# EasyEDA Pro project coildriver.eprj, schematic Schematic2
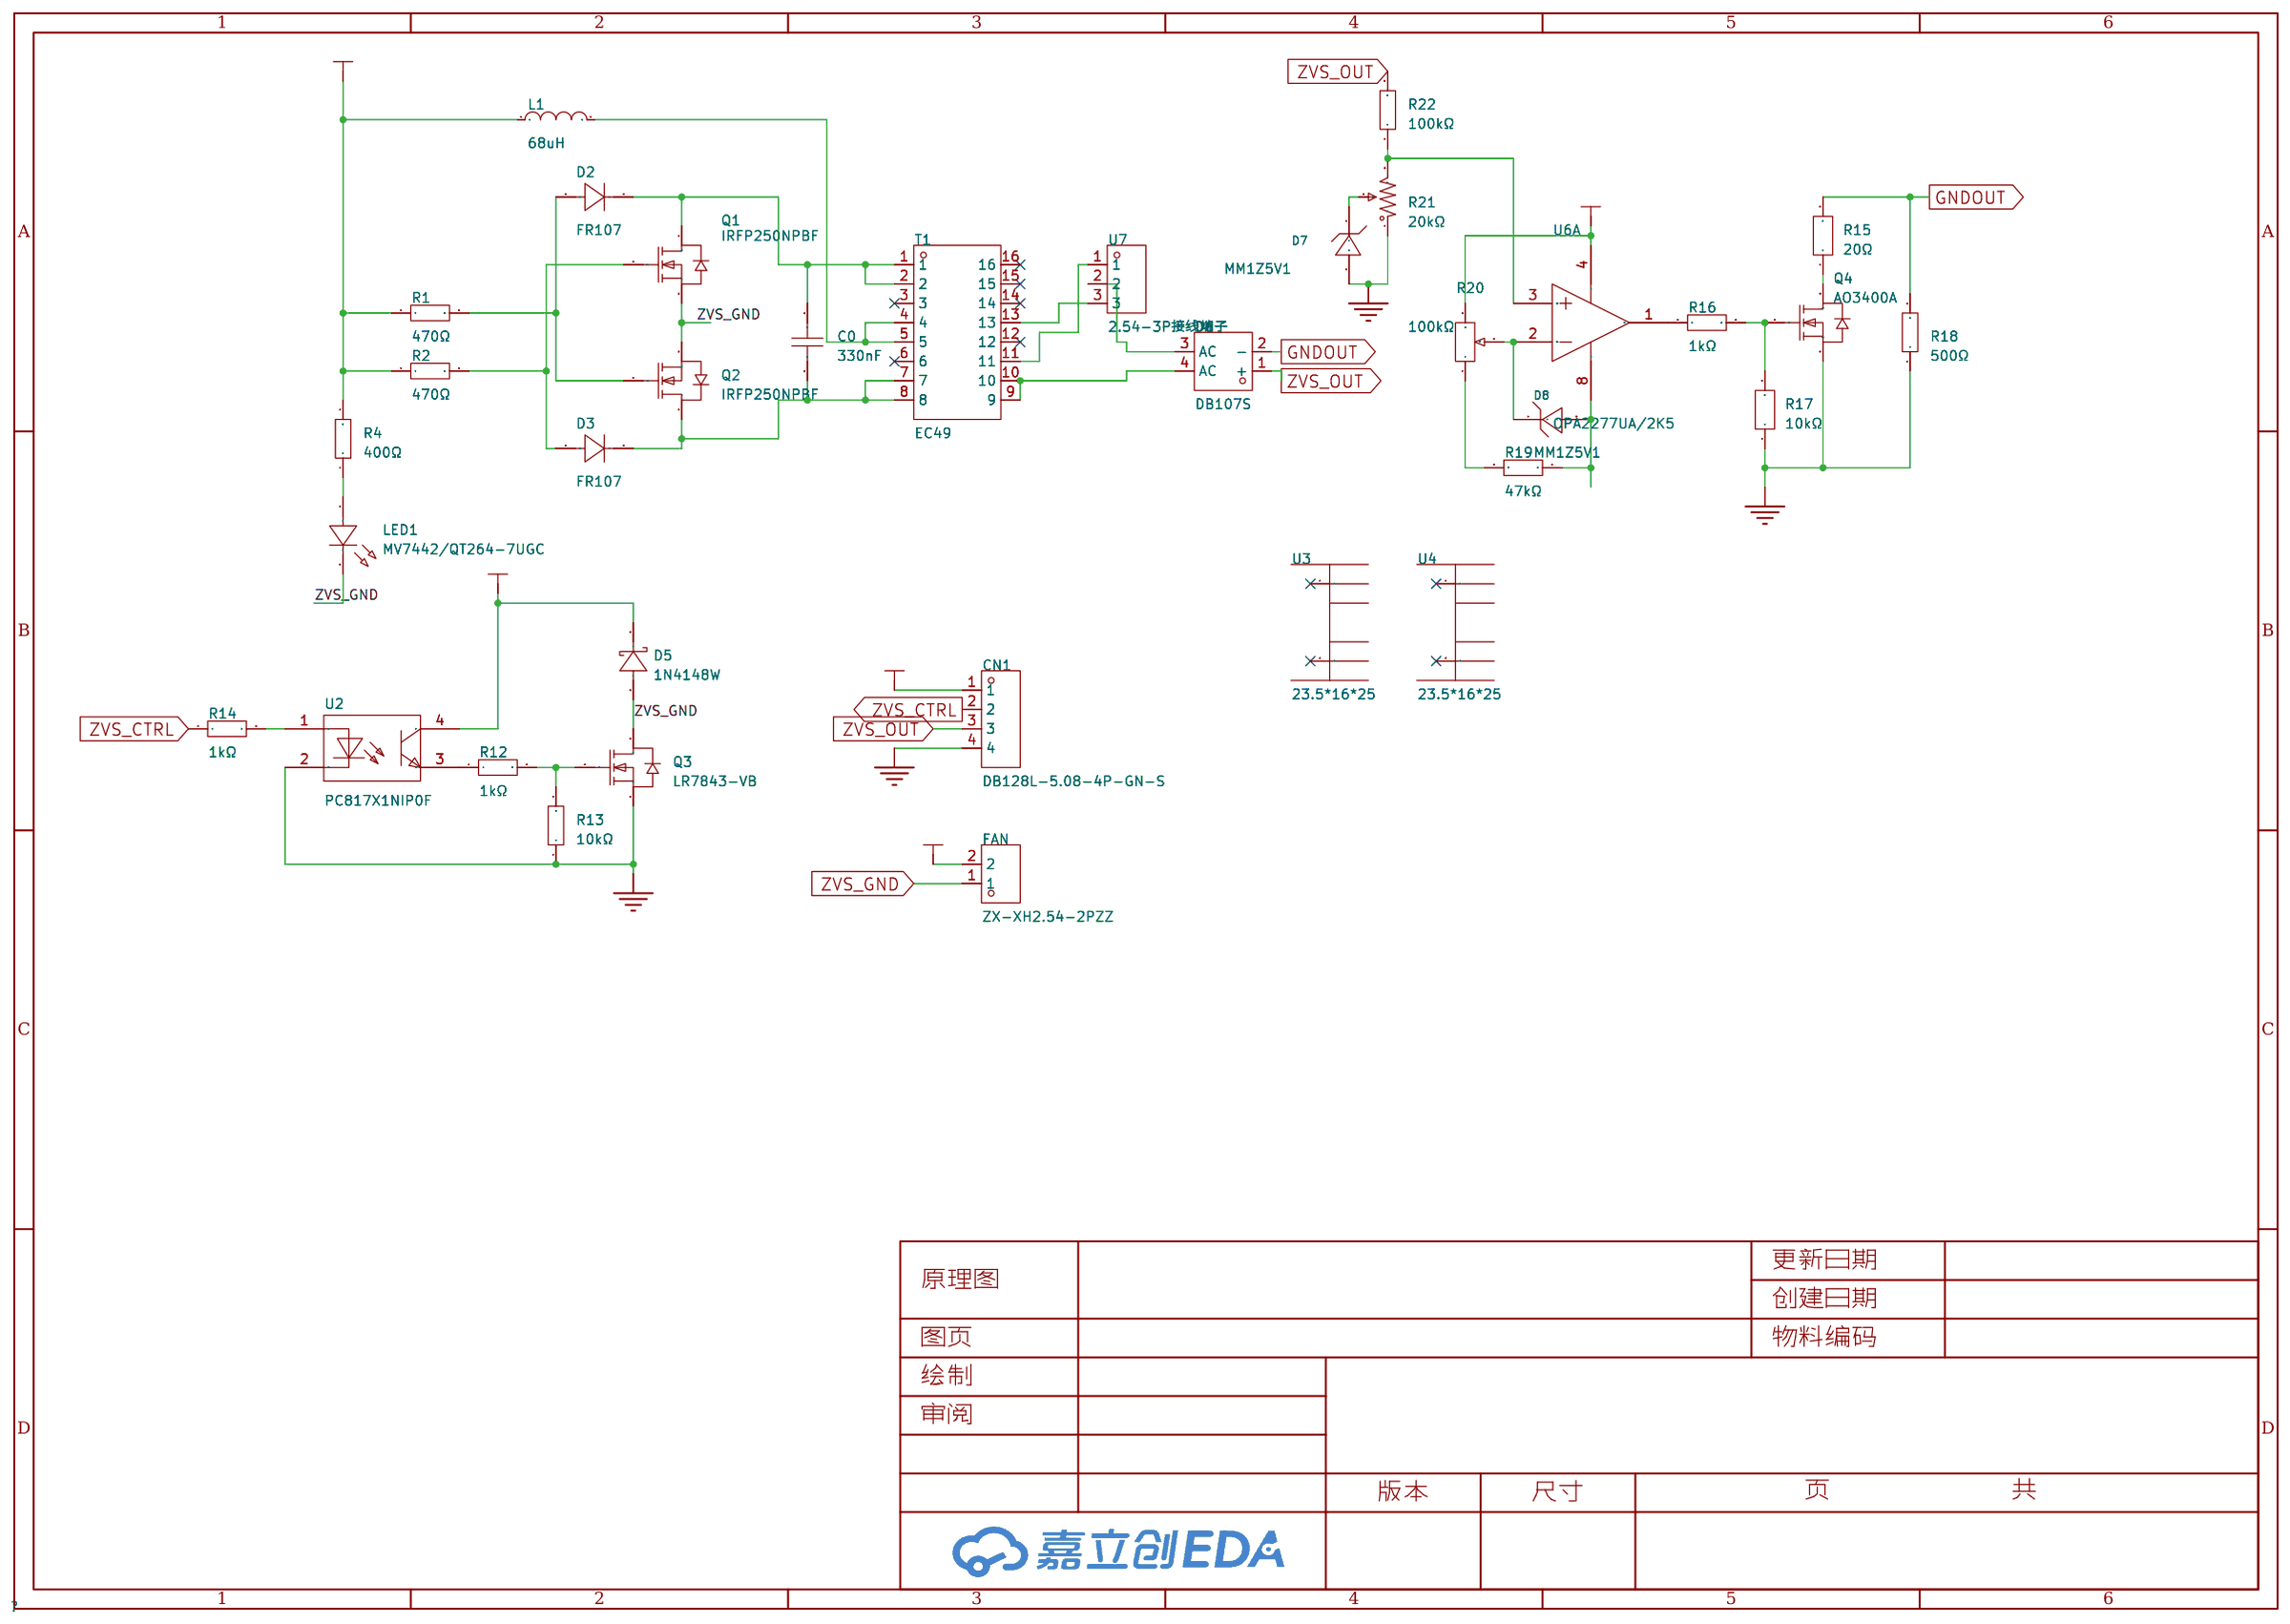
[diagram p1: schematic sheet]

## Parts
C0  330nF  [CAP-TH_L18.0-W6.0-P15.00-D0.8]
CN1  DB128L-5.08-4P-GN-S  [CONN-TH_4P_DB128L-5.08-4P-GN-S]
D2  FR107  [SOD-123FL_L2.7-W1.8-LS3.8-RD]
D3  FR107  [SOD-123FL_L2.7-W1.8-LS3.8-RD]
D5  1N4148W  [SOD-123_L2.7-W1.6-LS3.7-FD]
D6  DB107S  [DBS_L8.2-W6.4-P5.10-LS10.0-BL]
D7  MM1Z5V1  [SOD-123_L2.8-W1.8-LS3.7-RD]
D8  MM1Z5V1  [SOD-123_L2.8-W1.8-LS3.7-RD]
FAN  ZX-XH2.54-2PZZ  [CONN-TH_2P-P2.50_HX25003-2A]
L1  68uH  [IND-TH_L21.0-W11.0-P10.00]
LED1  MV7442/QT264-7UGC  [LED-TH_BD3.0-P2.54-FD]
Q1  IRFP250NPBF  [TO-247AC-3_L15.8-W5.0-P5.46-L]
Q2  IRFP250NPBF  [TO-247AC-3_L15.8-W5.0-P5.46-L]
Q3  LR7843-VB  [TO-252-2_L6.6-W6.1-P4.58-LS9.9-BR]
Q4  AO3400A  [SOT-23-3_L2.9-W1.3-P1.90-LS2.4-BR]
R1  470Ω  [R1206]
R2  470Ω  [R1206]
R4  400Ω  [R0805]
R12  1kΩ  [R0603]
R13  10kΩ  [R0603]
R14  1kΩ  [R0603]
R15  20Ω  [RES-TH_BD4.5-L11.0-P15.00-D0.7]
R16  1kΩ  [R0603]
R17  10kΩ  [R0603]
R18  500Ω  [RES-TH_BD9.0-L31.5-P35.50-D0.8]
R19  47kΩ  [R0603]
R20  100kΩ  [RES-ADJ-TH_3P-L9.5-W4.9-P2.50-L_3296W]
R21  20kΩ  [RES-ADJ-TH_3P-L10.0-W10.0-P2.50-BL-BS]
R22  100kΩ  [R0603]
T1  EC49  [XFMR-TH_16P-L40.0-W40.0-P5.00-LS35.0-BL]
U2  PC817X1NIP0F  [OPTO-SMD-4_L4.6-W6.5-P2.54-LS10.3-BL]
U3  23.5*16*25  [HEATSINK-TH_L23.5-W16.0-P18.0_XSD2156-067]
U4  23.5*16*25  [HEATSINK-TH_L23.5-W16.0-P18.0_XSD2156-067]
U6  OPA2277UA/2K5  [SOIC-8_L5.0-W4.0-P1.27-LS6.0-BL]  (section 1)
U7  2.54-3P接线端子  [CONN-TH_2.54-3P]

## Library data of the parts
C0 = MPX334K31D2KN15800: LCSC Part Name: 330nF ±10% 275V 305V 310V 等级:X2; Supplier Part: C504201; Manufacturer: KNSCHA(科尼盛); Supplier Footprint: 插件,P=15mm; JLCPCB Part Class: 扩展库; Datasheet: https://atta.szlcsc.com/upload/public/pdf/source/20200409/C504201_262CED3AA358BCF37F005B56DB63EB22.pdf; Supplier: LCSC; Tolerance: ±10%; Voltage(AC): 275V；310V；305V; Subclass: X2; safety certification: UL；CUL；KC；ENEC；VDE；CQC; Operating Temperature: -40℃~+110℃
CN1 = DB128L-5.08-4P-GN-S: LCSC Part Name: 5.08mm 1x4P 排数:1 每排P数:4 直插; Supplier Part: C2827883; Manufacturer: DORABO(地博电气); Supplier Footprint: 插件,P=5.08mm; JLCPCB Part Class: 扩展库; Datasheet: https://atta.szlcsc.com/upload/public/pdf/source/20230106/B067FE0E641A396A370D47F93C345689.pdf; Supplier: LCSC; Structure: 1x4P; Pitch: 5.08mm; Color: 绿色; Mounting Style: 直插; Current Rating (Max): 18A; Voltage Rating (Max): 250V; Number of Pins: 4P; Number of Rows: 1; Wire Gauge - AWG: 12~30; Wire Gauge - mm2: 2.5; Number of PINs Per Row: 4; Operating Temperature Range: -40℃~+105℃
D2 D3 = FR107_C2760867: LCSC Part Name: 电压:1kV 电流:1A; Supplier Part: C2760867; Manufacturer: Slkor(萨科微); Supplier Footprint: SOD-123FL; JLCPCB Part Class: 扩展库; Datasheet: https://atta.szlcsc.com/upload/public/pdf/source/20210316/C2760867_0B45AFF5F62837EEEC945A80EBBE02AA.pdf; Supplier: LCSC; Diode Configuration: 独立式; Forward Voltage (Vf@If): 1.3V@1A; Reverse Voltage (Vr): 1kV; Average Rectified Current (Io): 1A; Reverse Leakage Current: 5uA@1kV; Reverse Recovery Time (trr): 500ns; Operating Temperature: -55℃~+150℃@(Tj)
D5 = 1N4148W_C7420318: LCSC Part Name: 电压:100V 电流:150mA; Supplier Part: C7420318; Manufacturer: 宏迦橙; Supplier Footprint: SOD-123; JLCPCB Part Class: 扩展库; Datasheet: https://atta.szlcsc.com/upload/public/pdf/source/20230828/E5C3F7A4272052930A7E03B75759BF50.pdf; Supplier: LCSC; Diode Configuration: 独立式; Forward Voltage (Vf@If): 1.25V@150mA; Reverse Voltage (Vr): 100V; Average Rectified Current (Io): 150mA; Power Dissipation: 400mW; Reverse Leakage Current: 1uA@75V; Reverse Recovery Time (trr): 4ns; Operating Temperature: -55℃~+150℃
D6 = DB107S_C5377: LCSC Part Name: 电压:1kV 电流:1A; Supplier Part: C5377; Manufacturer: MDD(辰达半导体); Supplier Footprint: DBS; JLCPCB Part Class: Extended Part; Datasheet: https://atta.szlcsc.com/upload/public/pdf/source/20230823/A59C303B9E2BAE19B2E40C847717A366.pdf; Supplier: LCSC; Forward Voltage (Vf@If): 1.1V@1A; Reverse Voltage (Vr): 1kV; Rectified Current: 1A; Reverse Leakage Current (Ir): 10uA@1kV; Peak Forward Surge Current: 30A; Operating Temperature: -55℃~+150℃@(Tj)
D7 D8 = MM1Z5V1_C112534: Supplier Part: C112534; Manufacturer: 晶导微电子; Supplier Footprint: SOD-123; JLCPCB Part Class: 扩展库; Datasheet: https://atta.szlcsc.com/upload/public/pdf/source/20190326/C382779_93A8490AC8548BE170FED91286A619FB.pdf; Supplier: LCSC; Diode Configuration: 独立式; Zener Voltage (Nom): 5.1V; Reverse Leakage Current (Ir): 2uA@1.5V; Zener Voltage (Range): 4.8V~5.4V; Power Dissipation: 500mW; Zener Impedance (Zzt): 130Ω; Tolerance: ±6%
FAN = ZX-XH2.54-2PZZ: Supplier Part: C7429632; Manufacturer: Megastar(兆星); Supplier Footprint: 插件,P=2.54mm; JLCPCB Part Class: 扩展库; Datasheet: https://atta.szlcsc.com/upload/public/pdf/source/20230619/19BA6947230AA44A04D3EDD65E618FD0.pdf; Supplier: LCSC; Pins Structure: 1x2P; Pitch: 2.54mm; Mounting Style: 直插; Reference Series: XH; Number of Pins: 2P; Number of Rows: 1; Number of PINs Per Row: 2; Current Rating (Max): 3A; Contact Material: 黄铜; Contact Plating: 锡; Operating Temperature Range: -25℃~+85℃
L1 = SLT065125T680MTB: LCSC Part Name: 磁环电感 68uH ±20%; Supplier Part: C908340; Manufacturer: Sunltech(韩国顺磁); Supplier Footprint: 插件; JLCPCB Part Class: 扩展库; Datasheet: https://atta.szlcsc.com/upload/public/pdf/source/20201022/C908340_B9E676A8CE1D5E7140E465A9B41BC04C.pdf; Supplier: LCSC; Tolerance: ±20%; DC Resistance: 50mΩ; Type: 磁环电感
LED1 = MV7442/QT264-7UGC: Supplier Part: C17701866; Manufacturer: EVERLIGHT(亿光); Supplier Footprint: 插件; Datasheet: https://atta.szlcsc.com/upload/public/pdf/source/20230912/D387E63BEA7E9939EEB3DC7E43700318.pdf; Supplier: LCSC
Q1 Q2 = IRFP250NPBF: LCSC Part Name: 1个N沟道 耐压:200V 电流:30A; Supplier Part: C2580; Manufacturer: Infineon(英飞凌); Supplier Footprint: TO-247AC-3; JLCPCB Part Class: 扩展库; Datasheet: https://atta.szlcsc.com/upload/public/pdf/source/20140906/1457707236269.pdf; Supplier: LCSC; Type: 1个N沟道; Drain Source Voltage (Vdss): 200V; Continuous Drain Current (Id): 30A; Power Dissipation (Pd): 214W; Drain Source On Resistance (RDS(on)@Vgs,Id): 75mΩ@10V,18A; Gate Threshold Voltage (Vgs(th)@Id): 4V@250uA; Total Gate Charge (Qg@Vgs): 123nC@10V; Input Capacitance (Ciss@Vds): 2.159nF@25V; Operating Temperature: -55℃~+175℃@(Tj)
Q3 = LR7843-VB: LCSC Part Name: 1个N沟道 耐压:30V 电流:120A; Supplier Part: C5137375; Manufacturer: VBsemi(微碧半导体); Supplier Footprint: TO-252; JLCPCB Part Class: 扩展库; Datasheet: https://atta.szlcsc.com/upload/public/pdf/source/20230505/168126473CAC651DFC47C090452CBF08.pdf; Supplier: LCSC; Type: 1个N沟道; Drain Source Voltage (Vdss): 30V; Continuous Drain Current (Id): 120A; Drain Source On Resistance (RDS(on)@Vgs,Id): 2.3mΩ@10V,120A
Q4 = AO3400A_C20917: LCSC Part Name: 1个N沟道 耐压:30V 电流:5.7A; Supplier Part: C20917; Manufacturer: AOS; Supplier Footprint: SOT-23-3L; JLCPCB Part Class: 基础库; Datasheet: https://atta.szlcsc.com/upload/public/pdf/source/20140107/1457706668533.pdf; Supplier: LCSC; Type: 1个N沟道; Drain Source Voltage (Vdss): 30V; Continuous Drain Current (Id): 5.7A; Power Dissipation (Pd): 1.4W; Drain Source On Resistance (RDS(on)@Vgs,Id): 26.5mΩ@10V,5.7A; Gate Threshold Voltage (Vgs(th)@Id): 1.5V@250uA; Total Gate Charge (Qg@Vgs): 7nC@4.5V; Input Capacitance (Ciss@Vds): 630pF@15V; Operating Temperature: -55℃~+150℃@(Tj)
R1 R2 = 1206W4F4700T5E: LCSC Part Name: 470Ω ±1% 250mW 厚膜电阻; Supplier Part: C4502; Manufacturer: UNI-ROYAL(厚声); Supplier Footprint: 1206; JLCPCB Part Class: 扩展库; Datasheet: https://atta.szlcsc.com/upload/public/pdf/source/20200306/C422600_1E6D84923E4A46A82E41ADD87F860B5C.pdf; Supplier: LCSC; Type: 厚膜电阻; Tolerance: ±1%; Power(Watts): 250mW; Overload Voltage (Max): 200V; Temperature Coefficient: ±100ppm/℃; Operating Temperature Range: -55℃~+155℃
R4 = TR0805B400RP0525Z: LCSC Part Name: 薄膜电阻 400Ω ±0.1% 125mW; Supplier Part: C153298; Manufacturer: EVER OHMS(天二科技); Supplier Footprint: 0805; JLCPCB Part Class: 扩展库; Datasheet: https://atta.szlcsc.com/upload/public/pdf/source/20190527/C149900_32B1354086E9F6A772108AB7B2B7A514.pdf; Supplier: LCSC; Type: 薄膜电阻; Tolerance: ±0.1%; Power(Watts): 125mW; Overload Voltage (Max): 150V; Temperature Coefficient: ±25ppm/℃; Operating Temperature Range: -55℃~+155℃
R12 R14 R16 = RC0603FR-071KL: LCSC Part Name: 厚膜电阻 1kΩ ±1% 100mW; Supplier Part: C22548; Manufacturer: YAGEO(国巨); Supplier Footprint: 0603; JLCPCB Part Class: 扩展库; Datasheet: https://atta.szlcsc.com/upload/public/pdf/source/20180316/70C0E2BDAE7FCC62C531A5A58D202EE1.pdf; Supplier: LCSC; Type: 厚膜电阻; Tolerance: ±1%; Power(Watts): 100mW; Overload Voltage (Max): 75V; Temperature Coefficient: ±100ppm/℃; Operating Temperature Range: -55℃~+155℃
R13 = 0603WAF1002T5E: LCSC Part Name: 厚膜电阻 10kΩ ±1% 100mW; Supplier Part: C25804; Manufacturer: UNI-ROYAL(厚声); Supplier Footprint: 0603; JLCPCB Part Class: 基础库; Datasheet: https://atta.szlcsc.com/upload/public/pdf/source/20200306/C422600_1E6D84923E4A46A82E41ADD87F860B5C.pdf; Supplier: LCSC; Type: 厚膜电阻; Tolerance: ±1%; Power(Watts): 100mW; Overload Voltage (Max): 75V; Temperature Coefficient: ±100ppm/℃; Operating Temperature Range: -55℃~+155℃
R15 = CR1W-20Ω±5%-6T63: LCSC Part Name: 碳膜电阻 20Ω ±5% 1W; Supplier Part: C2897143; Manufacturer: VO(翔胜); Supplier Footprint: 插件,D4.5xL11mm; JLCPCB Part Class: 扩展库; Datasheet: https://atta.szlcsc.com/upload/public/pdf/source/20210803/C2857407_45FF53FE186CAB545115AD37303966CD.pdf; Supplier: LCSC; Type: 碳膜电阻; Tolerance: ±5%; Overload Voltage (Max): 500V; Power(Watts): 1W; Temperature Coefficient: ±350ppm/℃; Operating Temperature Range: -55℃~+155℃
R17 = FRC0603J103TS: LCSC Part Name: 10kΩ ±5% 100mW 厚膜电阻; Supplier Part: C2930027; Manufacturer: FOJAN(富捷); Supplier Footprint: 0603; JLCPCB Part Class: 扩展库; Datasheet: https://atta.szlcsc.com/upload/public/pdf/source/20211221/925EC7D7225764EE0046F22065062C87.pdf; Supplier: LCSC; Type: 厚膜电阻; Tolerance: ±5%; Power(Watts): 100mW; Overload Voltage (Max): 75V; Temperature Coefficient: ±100ppm/℃; Operating Temperature Range: -55℃~+155℃
R18 = EWWR0008J500RT9: LCSC Part Name: 绕线电阻 500Ω ±5% 8W; Supplier Part: C349059; Manufacturer: RESI(开步睿思); Supplier Footprint: 插件,D9xL31.5mm; JLCPCB Part Class: 扩展库; Datasheet: https://atta.szlcsc.com/upload/public/pdf/source/20230201/1B3D2D7E42CE9D2055BF95E570A62506.pdf; Supplier: LCSC; Type: 绕线电阻; Tolerance: ±5%; Power(Watts): 8W; Temperature Coefficient: ±250ppm/℃; Operating Temperature Range: -55℃~+155℃
R19 = 0603WAF4702T5E: LCSC Part Name: 47kΩ ±1% 100mW 厚膜电阻; Supplier Part: C25819; Manufacturer: UNI-ROYAL(厚声); Supplier Footprint: 0603; JLCPCB Part Class: 基础库; Datasheet: https://atta.szlcsc.com/upload/public/pdf/source/20200306/C422600_1E6D84923E4A46A82E41ADD87F860B5C.pdf; Supplier: LCSC; Type: 厚膜电阻; Tolerance: ±1%; Power(Watts): 100mW; Overload Voltage (Max): 75V; Temperature Coefficient: ±100ppm/℃; Operating Temperature Range: -55℃~+155℃
R20 = 3296W-1-104: LCSC Part Name: 100kΩ ±10%; Supplier Part: C118963; Manufacturer: BOCHEN(博晨); Supplier Footprint: 插件; JLCPCB Part Class: 扩展库; Datasheet: https://atta.szlcsc.com/upload/public/pdf/source/20171114/C118963_15106326662041117450.pdf; Supplier: LCSC; Tolerance: ±10%
R21 = 3296W-1-203: LCSC Part Name: 20kΩ ±10%; Supplier Part: C118936; Manufacturer: BOCHEN(博晨); Supplier Footprint: 插件; JLCPCB Part Class: 扩展库; Datasheet: https://atta.szlcsc.com/upload/public/pdf/source/20171114/C118936_15106326608611117425.pdf; Supplier: LCSC; Tolerance: ±10%
R22 = 0603WAF1003T5E: LCSC Part Name: 100kΩ ±1% 100mW 厚膜电阻; Supplier Part: C25803; Manufacturer: UNI-ROYAL(厚声); Supplier Footprint: 0603; JLCPCB Part Class: Basic Part; Datasheet: https://atta.szlcsc.com/upload/public/pdf/source/20200306/C422600_1E6D84923E4A46A82E41ADD87F860B5C.pdf; Supplier: LCSC; Type: 厚膜电阻; Tolerance: ±1%; Power(Watts): 100mW; Overload Voltage (Max): 75V; Temperature Coefficient: ±100ppm/℃; Operating Temperature Range: -55℃~+155℃
T1 = EC49: Supplier Part: C9900117156; Supplier Footprint: 变压器; Supplier: LCSC
U2 = PC817X1NIP0F: LCSC Part Name: PC817X1NIP0F （A档） A档 停产; Supplier Part: C95783; Manufacturer: SHARP(夏普); Supplier Footprint: SMD-4P; JLCPCB Part Class: 扩展库; Datasheet: https://atta.szlcsc.com/upload/public/pdf/source/20170306/1488763833610.pdf; Supplier: LCSC
U3 U4 = 23.5*16*25: LCSC Part Name: 23.5*16*25   2个钉散热片; Supplier Part: C4661; Manufacturer: XSD(鑫顺达); JLCPCB Part Class: 扩展库; Datasheet: https://atta.szlcsc.com/upload/public/pdf/source/20180404/C4661_AA4279CA2C163B7D4FDABF987BD2FAA9.pdf; Supplier: LCSC; brand: XSD(鑫顺达); ProductSize: 23.5*16*25MM; Colour: 白色; TextureOfMaterial: 6063-T5铝; SurfaceTreatment: 本色洗白; NumberOfNails: 2
U6 = OPA2277UA/2K5: LCSC Part Name: OPA2277UA; Supplier Part: C24460; Manufacturer: TI(德州仪器); Supplier Footprint: SOIC-8; JLCPCB Part Class: 扩展库; Datasheet: https://www.ti.com/cn/lit/gpn/opa2277; Supplier: LCSC; Number of Circuits: 双路; Gain Bandwidth Product(GBP): 1MHz; Current - Input Bias(Ib): 4nA; Slew Rate(SR): 0.8V/us; Output Current: 35mA; Supply Current: 790uA; Operating Temperature: -40℃~+85℃
U7 = 2.54-3P接线端子: LCSC Part Name: 接线端子 2.54mm 3P; Supplier Part: C68305; Manufacturer: BOOMELE(博穆精密); Supplier Footprint: P=2.54mm; JLCPCB Part Class: 扩展库; Datasheet: https://atta.szlcsc.com/upload/public/pdf/source/20240131/0FC6625A1FDA39D18380D30494E5C016.pdf; Supplier: LCSC

## Nets
12V: CN1.1 D5.2(K) FAN.2 L1.1 R1.1 R2.1 R4.2 R20.3 U2.4 U6.4(V-)
GND: CN1.4 D7.2(A) Q3.3(S) Q4.2(S) R13.1 R17.1 R18.1 R21.1 U2.2
GNDOUT: D6.2(-) R15.2 R18.2
ZVS_CTRL: CN1.2 R14.1
ZVS_GND: D5.1(A) FAN.1 LED1.2(K) Q1.3(S) Q2.3(S) Q3.2(D)
ZVS_OUT: CN1.3 D6.1(+) R22.2
$1N2002: C0.2 D2.1(K) Q1.2(D) T1.1 T1.2
$1N2003: C0.1 D3.1(K) Q2.2(D) T1.7 T1.8
$1N2004: D2.2(A) Q2.1(G) R1.2
$1N2005: D3.2(A) Q1.1(G) R2.2
$1N2006: L1.2 T1.4 T1.5
$1N2007: LED1.1(A) R4.1
$1N2014: T1.11 U7.1
$1N2019: R12.1 U2.3
$1N2020: Q3.1(G) R12.2 R13.2
$1N2022: R14.2 U2.1
$1N5388: Q4.3(D) R15.1
$1N5546: R16.1 U6.1(OUT A)
$1N5550: Q4.1(G) R16.2 R17.2
$1N5594: D6.4(AC) T1.9 T1.10
$1N5608: D6.3(AC) U7.2
$1N6234: D8.2(A) R19.1 U6.8(V+)
$1N6240: R19.2 R20.1
$1N6394: D8.1(K) R20.2 U6.2(IN A-)
$1N7515: D7.1(K) R21.2
$1N7525: R21.3 R22.1 U6.3(IN A+)
$1N8658: T1.13 U7.3

Not connected (* = marked no-connect by the designer): T1 3* 6* 12* 14* 15* 16*; U3 1* 2*; U4 1* 2*
